# Altium project eBug2014-CameraArray.PrjPcb
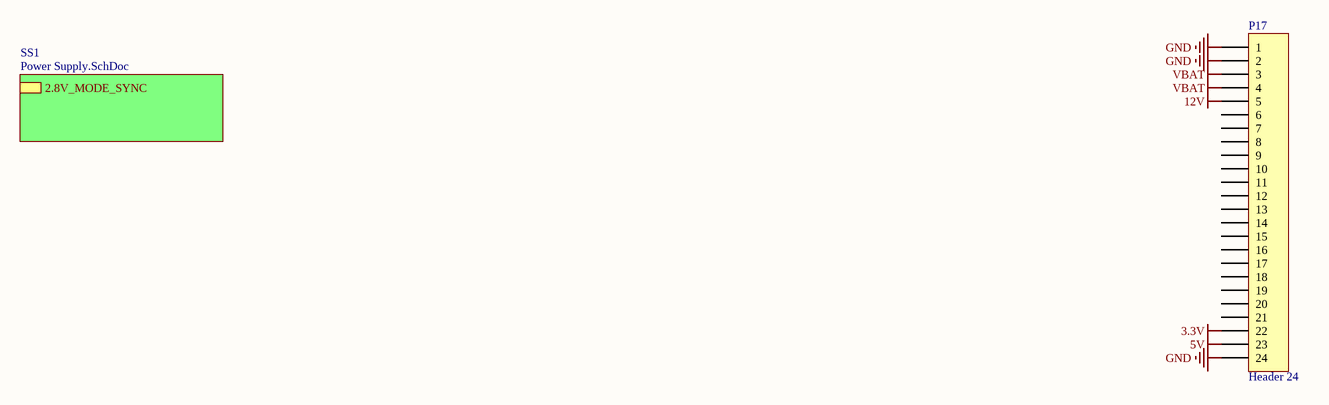
[diagram p0: Top Level.SchDoc]
11 sheets, 61 parts. Net scope: hierarchical (ports join the sheet entries above them; power ports are global).
Board file: PCB.PcbDoc
Sheets:
  Top Level.SchDoc
    SS1 = Power Supply.SchDoc
  Camera 1-2.SchDoc
  Camera 3-4.SchDoc
  Camera 5-6.SchDoc
  Camera 7-8.SchDoc
  Camera 9-10.SchDoc
  Camera 11-12.SchDoc
  Camera 13-14.SchDoc
  Camera 15-16.SchDoc
  LPC.SchDoc

## Sheet Top Level.SchDoc
size A4; DrawnBy: Nick D'Ademo; DocumentNumber: 1; Revision: A; SheetNumber: 1; SheetTotal: 11

### Parts
P17  Header 24  [2-1734592-4]

### Sub-sheets
SS1 = Power Supply.SchDoc: 2.8V_MODE_SYNC

### Nets
3.3V: P17.22
5V: P17.23
12V: P17.5
GND: P17.1 P17.2 P17.24
VBAT: P17.3 P17.4

Not connected (* = marked no-connect by the designer): P17 6 7 8 9 10 11 12 13 14 15 16 17 18 19 20 21

### Library data of the parts
P17 = Header 24: GLOBAL CONNECTOR TECHNOLOGY - FFC2B10-24-T - FFC/FPC CONNECTOR, RECEPTACLE, 24POS, 1ROW; LatestRevisionDate: 17-Jul-2002; LatestRevisionNote: Re-released for DXP Platform.; Publisher: Altium Limited

## Sheet Power Supply.SchDoc
size A; DrawnBy: Nick D'Ademo; DocumentNumber: 11; Revision: A; SheetNumber: 11; SheetTotal: 11
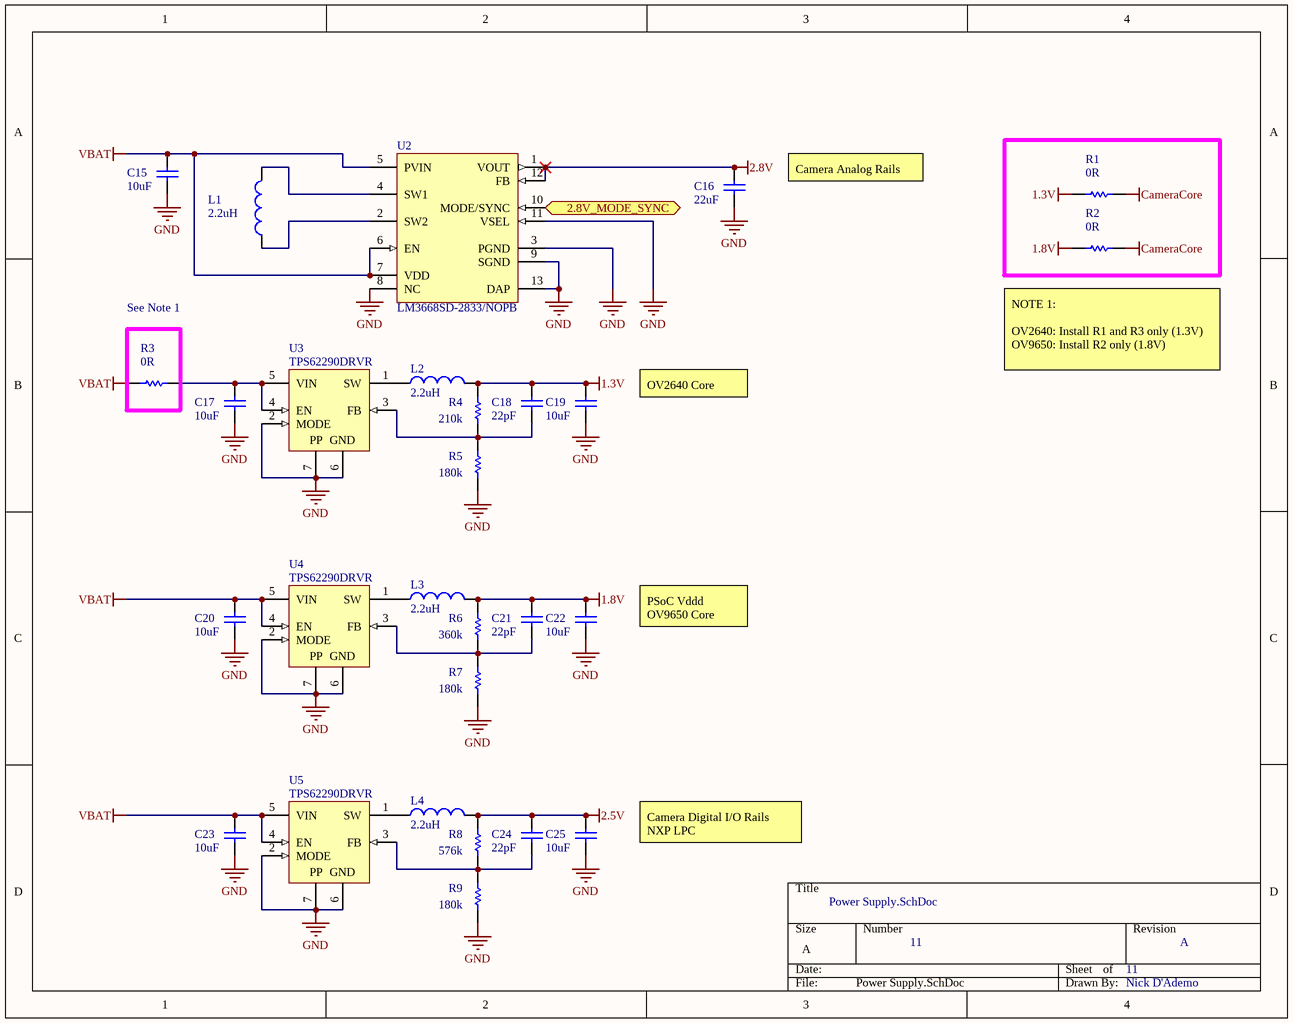
[diagram p1: Power Supply.SchDoc]

### Parts
C15  value 10uF  [CAPC2012N]  (hidden comment: Cap)
C16  value 22uF  [CAPC2012N]  (hidden comment: Cap)
C17  value 10uF  [CAPC2012N]  (hidden comment: Cap)
C18  value 22pF  [CAPC1005N]  (hidden comment: Cap)
C19  value 10uF  [CAPC2012N]  (hidden comment: Cap)
C20  value 10uF  [CAPC2012N]  (hidden comment: Cap)
C21  value 22pF  [CAPC1005N]  (hidden comment: Cap)
C22  value 10uF  [CAPC2012N]  (hidden comment: Cap)
C23  value 10uF  [CAPC2012N]  (hidden comment: Cap)
C24  value 22pF  [CAPC1005N]  (hidden comment: Cap)
C25  value 10uF  [CAPC2012N]  (hidden comment: Cap)
L1  value 2.2uH  [COILCRAFT_LPS4018]  (hidden comment: Inductor)
L2  value 2.2uH  [COILCRAFT_LPS4018]  (hidden comment: Inductor)
L3  value 2.2uH  [COILCRAFT_LPS4018]  (hidden comment: Inductor)
L4  value 2.2uH  [COILCRAFT_LPS4018]  (hidden comment: Inductor)
R1  value 0R  [RESC1608N]  (hidden comment: Res1)
R2  value 0R  [RESC1608N]  (hidden comment: Res1)
R3  value 0R  [RESC1608N]  (hidden comment: Res1)
R4  value 210k  [RESC1608N]  (hidden comment: Res1)
R5  value 180k  [RESC1608N]  (hidden comment: Res1)
R6  value 360k  [RESC1608N]  (hidden comment: Res1)
R7  value 180k  [RESC1608N]  (hidden comment: Res1)
R8  value 576k  [RESC1608N]  (hidden comment: Res1)
R9  value 180k  [RESC1608N]  (hidden comment: Res1)
U2  LM3668SD-2833/NOPB  [SDF12A]
U3  TPS62290DRVR  [DRV6-1600X1000TP]
U4  TPS62290DRVR  [DRV6-1600X1000TP]
U5  TPS62290DRVR  [DRV6-1600X1000TP]

### Blocks framed on the sheet
See Note 1: R3

### Ports
2.8V_MODE_SYNC

### Nets
1.3V: C18.2 C19.2 L2.2 R1.2 R4.2
1.8V: C21.2 C22.2 L3.2 R2.2 R6.2
2.5V: C24.2 C25.2 L4.2 R8.2
2.8V: C16.2 U2.1(VOUT) U2.12(FB)
CameraCore: R1.1 R2.1
GND: C15.1 C16.1 C17.1 C19.1 C20.1 C22.1 C23.1 C25.1 R5.1 R7.1 R9.1 U2.3(PGND) U2.8(NC) U2.9(SGND) U2.11(VSEL) U2.13(DAP) U3.2(MODE) U3.6(GND) U3.7(PP) U4.2(MODE) U4.6(GND) U4.7(PP) U5.2(MODE) U5.6(GND) U5.7(PP)
VBAT: C15.2 C20.2 C23.2 R3.2 U2.5(PVIN) U2.6(EN) U2.7(VDD) U4.4(EN) U4.5(VIN) U5.4(EN) U5.5(VIN)
NetC17_2: C17.2 R3.1 U3.4(EN) U3.5(VIN)
NetC18_1: C18.1 R4.1 R5.2 U3.3(FB)
NetC21_1: C21.1 R6.1 R7.2 U4.3(FB)
NetC24_1: C24.1 R8.1 R9.2 U5.3(FB)
NetL1_1: L1.1 U2.2(SW2)
NetL1_2: L1.2 U2.4(SW1)
NetL2_1: L2.1 U3.1(SW)
NetL3_1: L3.1 U4.1(SW)
NetL4_1: L4.1 U5.1(SW)
NetU2_10: U2.10(MODE/SYNC) ; port 2.8V_MODE_SYNC

### Notes on the sheet
- Camera Analog Rails
- (near R2) NOTE 1:
  OV2640: Install R1 and R3 only (1.3V)
  OV9650: Install R2 only (1.8V)
- OV2640 Core
- PSoC Vddd
  OV9650 Core
- Camera Digital I/O Rails
  NXP LPC

### Library data of the parts
C15 C17 C19 C20 C22 C23 C25 = Cap: TAIYO YUDEN - LMK212 BJ106MG-T - CAP, MLCC, X5R, 10UF, 10V, 0805; Published: 8-Jun-2000; LatestRevisionDate: 17-Jul-2002; LatestRevisionNote: Re-released for DXP Platform.; PackageReference: RAD-0.3; Publisher: Altium Limited; PackageDescription: Radial Cap, Thru-Hole; 2 Leads; 0.3 in Pin Spacing
C16 = Cap: TAIYO YUDEN - LMK212BJ226MG-T - CAPACITOR CERAMIC 22UF, 10V, X5R, 0805; Published: 8-Jun-2000; LatestRevisionDate: 17-Jul-2002; LatestRevisionNote: Re-released for DXP Platform.; PackageReference: RAD-0.3; Publisher: Altium Limited; PackageDescription: Radial Cap, Thru-Hole; 2 Leads; 0.3 in Pin Spacing
C18 C21 C24 = Cap: Capacitor, NP0, ±5%, 25V, 0402; Published: 8-Jun-2000; LatestRevisionDate: 17-Jul-2002; LatestRevisionNote: Re-released for DXP Platform.; PackageReference: RAD-0.3; Publisher: Altium Limited; PackageDescription: Radial Cap, Thru-Hole; 2 Leads; 0.3 in Pin Spacing
L1-L4 = Inductor: COILCRAFT - LPS4018-222MRB - INDUCTOR, SHLD, 2.2UH, 20%, 1.5A, SMD; Code_IEC: 1005; Published: 8-Jun-2000; LatestRevisionDate: 29-May-2009; LatestRevisionNote: IPC-7351 Footprint Added.; PackageReference: 0402-A; Publisher: Altium Limited; PackageDescription: Chip Inductor; Code_JEITA: 0402
R1-R9 = Res1: Resistor, ±1%, 0.1W, 0603; Published: 8-Jun-2000; LatestRevisionDate: 17-Jul-2002; LatestRevisionNote: Re-released for DXP Platform.; PackageReference: AXIAL-0.3; Publisher: Altium Limited; PackageDescription: Axial Device, Thru-Hole; 2 Leads; 0.3 in Pin Spacing
U2 = LM3668SD-2833/NOPB: 1A, High Efficiency Dual Mode Single Inductor Buck-Boost DC/DC Converter, 12-pin LLP, Pb-Free; Manufacturer: National Semiconductor; PackageTopMarking: ZXYTT*S017B; PowerWise: Y; CompType: MiscPower; DatasheetVersion: Sep-2008; PackageVersion: revB, Jul-2008; PackageReference: SDF12A; PackageDescription: LLP, Plastic, Dual, 3 x 3 x 0.8mm Body, 12 Lead, 0.4mm Pitch, No Pullback; PartNumber: LM3668SD-2833/NOPB; RoHS: Y; PinCount: 12; High-Reliability: Y; ComponentLink1Description: Manufacturer URL; ComponentLink1URL: http://www.national.com/; ComponentLink2Description: LM3668 Datasheet; ComponentLink2URL: http://www.national.com/ds/LM/LM3668.pdf; ComponentLink3Description: LM3668 Web Page; ComponentLink3URL: http://www.national.com/pf/LM/LM3668.html; ComponentLink4Description: SDF12A Package Page; ComponentLink4URL: http://www.national.com/packaging/folders/sdf12a.html
U3-U5 = TPS62290DRVR: Buck Step Down Regulator with 2.3 to 6 V Input and 0.6 to 6 V Output, -40 to 85 degC, 6-Pin SON (DRV), Green (RoHS & no Sb/Br); Manufacturer: Texas Instruments; Duty Cycle(Max)(%): 100; Iout(Max)(A): 1; Iq(Typ)(mA): 0.015; Rating: Catalog; SubFamily: Step-Down Regulator; Switch Current Limit(Typ)(A): 1.4; Synchronous Rectification: TRUE; Vin(Max)(V): 6; Vin(Min)(V): 2.3; Vout(Min)(V): 0.6; DatasheetVersion: SLVS764C; PackageVersion: revE, Oct-2010; PackageReference: DRV6-1600X1000TP; PackageDescription: 6-Pin Plastic Small Outline No-Lead, 2 x 2 x 0.8 mm Body, 0.65 mm Pitch, Exposed Pad; Supplier 1: Digi-Key; Supplier Part Number 1: 296-27030-2-ND; Supplier 2: Digi-Key; Supplier Part Number 2: 296-27030-1-ND; Supplier 3: Digi-Key; Supplier Part Number 3: 296-27030-6-ND; Supplier 4: Newark; Supplier Part Number 4: 50M9135; Supplier 5: Mouser; Supplier Part Number 5: 595-TPS62290DRVR; Eco-Plan: Green (RoHS & no Sb/Br); Regulated Outputs(#): 1; Topology: Buck; Vout(Max)(V): 6; Mounting Technology: Surface Mount; PartNumber: TPS62290DRVR; ComponentLink1Description: Datasheet; ComponentLink1URL: http://www.ti.com/general/docs/lit/getliterature.tsp?genericPartNumber=TPS62290&fileType=pdf; ComponentLink2Description: Package Specification; ComponentLink2URL: http://www.ti.com/litv/pdf/mpds216d; ComponentLink3Description: URL Link1; ComponentLink3URL: Samples URL:http://www.ti.com/product/tps62290#samples

## Sheet Camera 1-2.SchDoc
size A; DrawnBy: Nick D'Ademo; DocumentNumber: 2; Revision: A; SheetNumber: 2; SheetTotal: 11
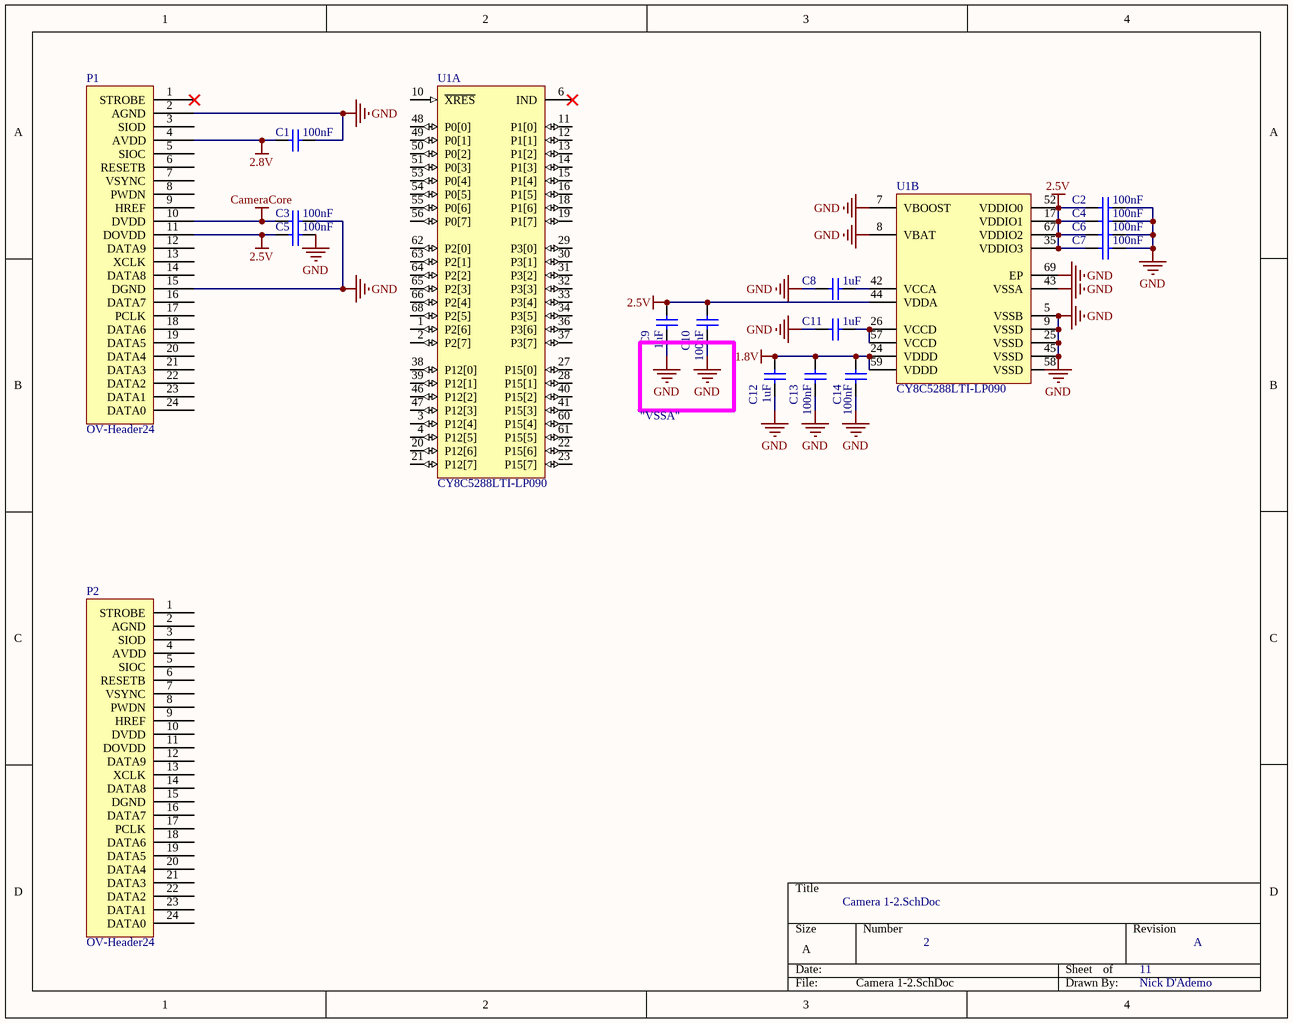
[diagram p2: Camera 1-2.SchDoc]

### Parts
C1  value 100nF  [CAPC1005N]  (hidden comment: Cap)
C2  value 100nF  [CAPC1005N]  (hidden comment: Cap)
C3  value 100nF  [CAPC1005N]  (hidden comment: Cap)
C4  value 100nF  [CAPC1005N]  (hidden comment: Cap)
C5  value 100nF  [CAPC1005N]  (hidden comment: Cap)
C6  value 100nF  [CAPC1005N]  (hidden comment: Cap)
C7  value 100nF  [CAPC1005N]  (hidden comment: Cap)
C8  value 1uF  [CAPC1005N]  (hidden comment: Cap)
C9  value 1uF  [CAPC1005N]  (hidden comment: Cap)
C10  value 100nF  [CAPC1005N]  (hidden comment: Cap)
C11  value 1uF  [CAPC1005N]  (hidden comment: Cap)
C12  value 1uF  [CAPC1005N]  (hidden comment: Cap)
C13  value 100nF  [CAPC1005N]  (hidden comment: Cap)
C14  value 100nF  [CAPC1005N]  (hidden comment: Cap)
P1  OV-Header24  [2-1734592-4_REVERSED]
P2  OV-Header24  [2-1734592-4_REVERSED]
U1  CY8C5288LTI-LP090  [CYP-LTX68_N]  (parts A,B of 2)

### Nets
1.8V: C12.2 C13.1 C14.1 U1.24(VDDD) U1.59(VDDD)
2.5V: C2.2 C4.2 C5.2 C6.2 C7.2 C9.2 C10.1 P1.11(DOVDD) U1.17(VDDIO1) U1.35(VDDIO3) U1.44(VDDA) U1.52(VDDIO0) U1.67(VDDIO2)
2.8V: C1.2 P1.4(AVDD)
CameraCore: C3.2 P1.10(DVDD)
GND: C1.1 C2.1 C3.1 C4.1 C5.1 C6.1 C7.1 C8.1 C9.1 C10.2 C11.1 C12.1 C13.2 C14.2 P1.2(AGND) P1.15(DGND) U1.5(VSSB) U1.7(VBOOST) U1.8(VBAT) U1.9(VSSD) U1.25(VSSD) U1.43(VSSA) U1.45(VSSD) U1.69(EP)
NetC8_2: C8.2 U1.42(VCCA)
NetC11_2: C11.2 U1.26(VCCD) U1.57(VCCD)

Not connected (* = marked no-connect by the designer): P1 1(STROBE)* 3(SIOD) 5(SIOC) 6(RESETB) 7(VSYNC) 8(PWDN) 9(HREF) 12(DATA9) 13(XCLK) 14(DATA8) 16(DATA7) 17(PCLK) 18(DATA6) 19(DATA5) 20(DATA4) 21(DATA3) 22(DATA2) 23(DATA1) 24(DATA0); P2 1(STROBE) 2(AGND) 3(SIOD) 4(AVDD) 5(SIOC) 6(RESETB) 7(VSYNC) 8(PWDN) 9(HREF) 10(DVDD) 11(DOVDD) 12(DATA9) 13(XCLK) 14(DATA8) 15(DGND) 16(DATA7) 17(PCLK) 18(DATA6) 19(DATA5) 20(DATA4) 21(DATA3) 22(DATA2) 23(DATA1) 24(DATA0); U1 1(P2[6]) 2(P2[7]) 3(P12[4]) 4(P12[5]) 6(IND)* 10(~{XRES}) 11(P1[0]) 12(P1[1]) 13(P1[2]) 14(P1[3]) 15(P1[4]) 16(P1[5]) 18(P1[6]) 19(P1[7]) 20(P12[6]) 21(P12[7]) 22(P15[6]) 23(P15[7]) 27(P15[0]) 28(P15[1]) 29(P3[0]) 30(P3[1]) 31(P3[2]) 32(P3[3]) 33(P3[4]) 34(P3[5]) 36(P3[6]) 37(P3[7]) 38(P12[0]) 39(P12[1]) 40(P15[2]) 41(P15[3]) 46(P12[2]) 47(P12[3]) 48(P0[0]) 49(P0[1]) 50(P0[2]) 51(P0[3]) 53(P0[4]) 54(P0[5]) 55(P0[6]) 56(P0[7]) 58(VSSD) 60(P15[4]) 61(P15[5]) 62(P2[0]) 63(P2[1]) 64(P2[2]) 65(P2[3]) 66(P2[4]) 68(P2[5])

### Notes on the sheet
- "VSSA"

### Library data of the parts
C1-C7 C10 C13 C14 = Cap: Capacitor, X7R, ±10%, 16V, 0402; Published: 8-Jun-2000; LatestRevisionDate: 17-Jul-2002; LatestRevisionNote: Re-released for DXP Platform.; PackageReference: RAD-0.3; Publisher: Altium Limited; PackageDescription: Radial Cap, Thru-Hole; 2 Leads; 0.3 in Pin Spacing
C8 C9 C11 C12 = Cap: Capacitor, X5R, ±10%, 10V, 0402; Published: 8-Jun-2000; LatestRevisionDate: 17-Jul-2002; LatestRevisionNote: Re-released for DXP Platform.; PackageReference: RAD-0.3; Publisher: Altium Limited; PackageDescription: Radial Cap, Thru-Hole; 2 Leads; 0.3 in Pin Spacing
P1 P2 = OV-Header24: TE CONNECTIVITY - 2-1734592-4 - CONN FPC BOTTOM 24POS 0.50MM R/A
U1 = CY8C5288LTI-LP089: PSoC Programmable System-on-Chip, 256 KB Flash, 38 GPIOs, 1.71 to 5.5 V, 68-Pin QFN (LTX68), Tray; Manufacturer: Cypress; CPU Core: ARM Cortex-M3; Flash (KB): 256; Max. Operating Frequency (MHz): 80; Max. Operating Voltage (V): 5.5; Min. Operating Voltage (V): 1.71; No. of GPIOs: 38; SRAM (KB): 64; DatasheetVersion: Rev. *D; PackageVersion: Rev. *E, 07/2012; PackageReference: LTX68; PackageDescription: 68-Pin Quad Flat No Lead, Body 8.00 x 8.00 mm, Pitch 0.40 mm; Max. Operating Temp. (degreesC): 85; Min. Operating Temp. (degreesC): -40; Packing: Tray; Mounting Technology: Surface Mount; Code_JEDEC: MO-220; PartNumber: CY8C5288LTI-LP089; ComponentLink1Description: Manufacturer URL; ComponentLink1URL: http://www.cypress.com/; ComponentLink2Description: Datasheet; ComponentLink2URL: http://www.cypress.com/?docID=47569; ComponentLink3Description: Package Specification; ComponentLink3URL: http://www.cypress.com/?docID=38892

## Sheet Camera 3-4.SchDoc
size A; DrawnBy: Nick D'Ademo; DocumentNumber: 3; Revision: A; SheetNumber: 3; SheetTotal: 11
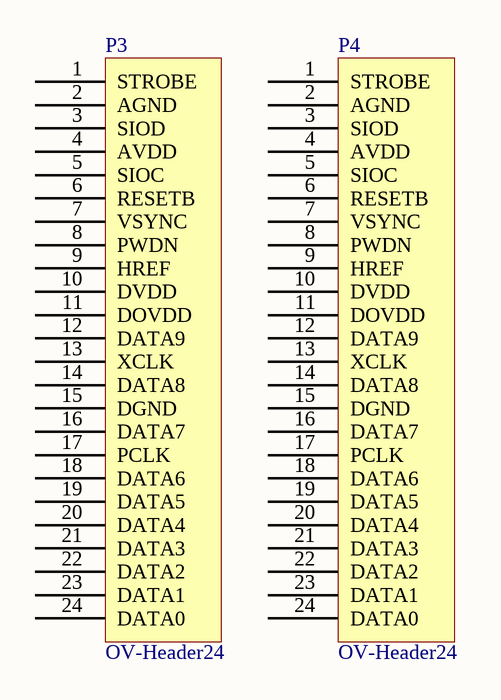
[diagram p3: Camera 3-4.SchDoc]

### Parts
P3  OV-Header24  [2-1734592-4_REVERSED]
P4  OV-Header24  [2-1734592-4_REVERSED]

### Nets

Not connected (* = marked no-connect by the designer): P3 1(STROBE) 2(AGND) 3(SIOD) 4(AVDD) 5(SIOC) 6(RESETB) 7(VSYNC) 8(PWDN) 9(HREF) 10(DVDD) 11(DOVDD) 12(DATA9) 13(XCLK) 14(DATA8) 15(DGND) 16(DATA7) 17(PCLK) 18(DATA6) 19(DATA5) 20(DATA4) 21(DATA3) 22(DATA2) 23(DATA1) 24(DATA0); P4 1(STROBE) 2(AGND) 3(SIOD) 4(AVDD) 5(SIOC) 6(RESETB) 7(VSYNC) 8(PWDN) 9(HREF) 10(DVDD) 11(DOVDD) 12(DATA9) 13(XCLK) 14(DATA8) 15(DGND) 16(DATA7) 17(PCLK) 18(DATA6) 19(DATA5) 20(DATA4) 21(DATA3) 22(DATA2) 23(DATA1) 24(DATA0)

### Library data of the parts
P3 P4 = OV-Header24: as P1 on sheet Camera 1-2

## Sheet Camera 5-6.SchDoc
size A; DrawnBy: Nick D'Ademo; DocumentNumber: 4; Revision: A; SheetNumber: 4; SheetTotal: 11
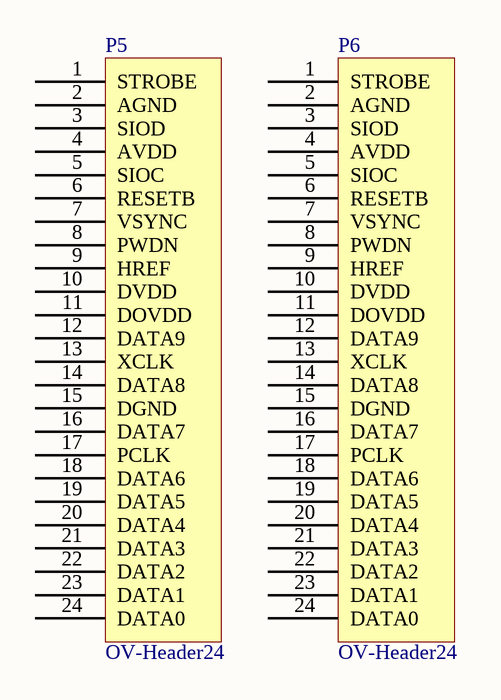
[diagram p4: Camera 5-6.SchDoc]

### Parts
P5  OV-Header24  [2-1734592-4_REVERSED]
P6  OV-Header24  [2-1734592-4_REVERSED]

### Nets

Not connected (* = marked no-connect by the designer): P5 1(STROBE) 2(AGND) 3(SIOD) 4(AVDD) 5(SIOC) 6(RESETB) 7(VSYNC) 8(PWDN) 9(HREF) 10(DVDD) 11(DOVDD) 12(DATA9) 13(XCLK) 14(DATA8) 15(DGND) 16(DATA7) 17(PCLK) 18(DATA6) 19(DATA5) 20(DATA4) 21(DATA3) 22(DATA2) 23(DATA1) 24(DATA0); P6 1(STROBE) 2(AGND) 3(SIOD) 4(AVDD) 5(SIOC) 6(RESETB) 7(VSYNC) 8(PWDN) 9(HREF) 10(DVDD) 11(DOVDD) 12(DATA9) 13(XCLK) 14(DATA8) 15(DGND) 16(DATA7) 17(PCLK) 18(DATA6) 19(DATA5) 20(DATA4) 21(DATA3) 22(DATA2) 23(DATA1) 24(DATA0)

### Library data of the parts
P5 P6 = OV-Header24: as P1 on sheet Camera 1-2

## Sheet Camera 7-8.SchDoc
size A; DrawnBy: Nick D'Ademo; DocumentNumber: 5; Revision: A; SheetNumber: 5; SheetTotal: 11
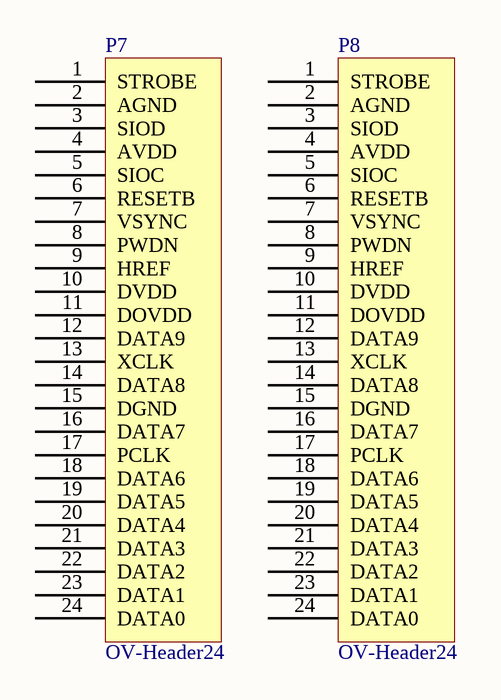
[diagram p5: Camera 7-8.SchDoc]

### Parts
P7  OV-Header24  [2-1734592-4_REVERSED]
P8  OV-Header24  [2-1734592-4_REVERSED]

### Nets

Not connected (* = marked no-connect by the designer): P7 1(STROBE) 2(AGND) 3(SIOD) 4(AVDD) 5(SIOC) 6(RESETB) 7(VSYNC) 8(PWDN) 9(HREF) 10(DVDD) 11(DOVDD) 12(DATA9) 13(XCLK) 14(DATA8) 15(DGND) 16(DATA7) 17(PCLK) 18(DATA6) 19(DATA5) 20(DATA4) 21(DATA3) 22(DATA2) 23(DATA1) 24(DATA0); P8 1(STROBE) 2(AGND) 3(SIOD) 4(AVDD) 5(SIOC) 6(RESETB) 7(VSYNC) 8(PWDN) 9(HREF) 10(DVDD) 11(DOVDD) 12(DATA9) 13(XCLK) 14(DATA8) 15(DGND) 16(DATA7) 17(PCLK) 18(DATA6) 19(DATA5) 20(DATA4) 21(DATA3) 22(DATA2) 23(DATA1) 24(DATA0)

### Library data of the parts
P7 P8 = OV-Header24: as P1 on sheet Camera 1-2

## Sheet Camera 9-10.SchDoc
size A; DrawnBy: Nick D'Ademo; DocumentNumber: 6; Revision: A; SheetNumber: 6; SheetTotal: 11
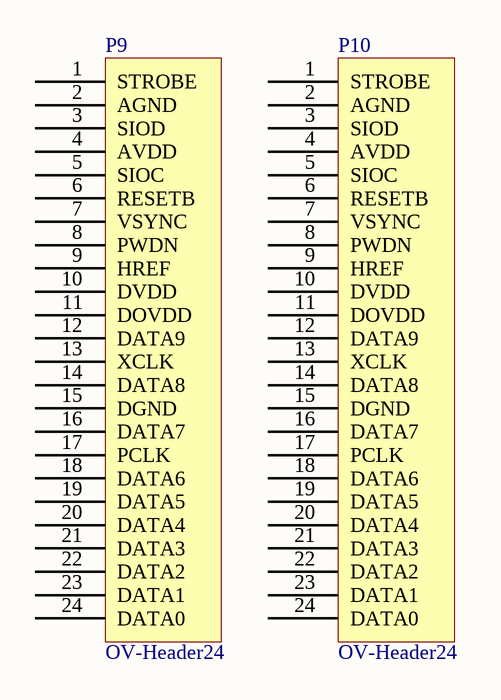
[diagram p6: Camera 9-10.SchDoc]

### Parts
P9  OV-Header24  [2-1734592-4_REVERSED]
P10  OV-Header24  [2-1734592-4_REVERSED]

### Nets

Not connected (* = marked no-connect by the designer): P9 1(STROBE) 2(AGND) 3(SIOD) 4(AVDD) 5(SIOC) 6(RESETB) 7(VSYNC) 8(PWDN) 9(HREF) 10(DVDD) 11(DOVDD) 12(DATA9) 13(XCLK) 14(DATA8) 15(DGND) 16(DATA7) 17(PCLK) 18(DATA6) 19(DATA5) 20(DATA4) 21(DATA3) 22(DATA2) 23(DATA1) 24(DATA0); P10 1(STROBE) 2(AGND) 3(SIOD) 4(AVDD) 5(SIOC) 6(RESETB) 7(VSYNC) 8(PWDN) 9(HREF) 10(DVDD) 11(DOVDD) 12(DATA9) 13(XCLK) 14(DATA8) 15(DGND) 16(DATA7) 17(PCLK) 18(DATA6) 19(DATA5) 20(DATA4) 21(DATA3) 22(DATA2) 23(DATA1) 24(DATA0)

### Library data of the parts
P9 P10 = OV-Header24: as P1 on sheet Camera 1-2

## Sheet Camera 11-12.SchDoc
size A; DrawnBy: Nick D'Ademo; DocumentNumber: 7; Revision: A; SheetNumber: 7; SheetTotal: 11
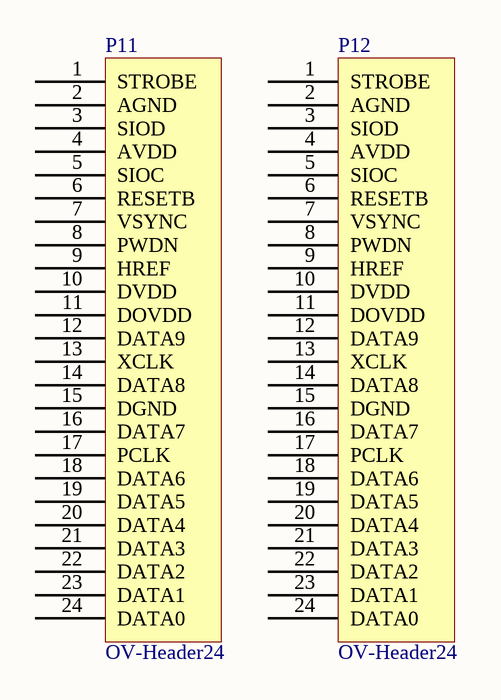
[diagram p7: Camera 11-12.SchDoc]

### Parts
P11  OV-Header24  [2-1734592-4_REVERSED]
P12  OV-Header24  [2-1734592-4_REVERSED]

### Nets

Not connected (* = marked no-connect by the designer): P11 1(STROBE) 2(AGND) 3(SIOD) 4(AVDD) 5(SIOC) 6(RESETB) 7(VSYNC) 8(PWDN) 9(HREF) 10(DVDD) 11(DOVDD) 12(DATA9) 13(XCLK) 14(DATA8) 15(DGND) 16(DATA7) 17(PCLK) 18(DATA6) 19(DATA5) 20(DATA4) 21(DATA3) 22(DATA2) 23(DATA1) 24(DATA0); P12 1(STROBE) 2(AGND) 3(SIOD) 4(AVDD) 5(SIOC) 6(RESETB) 7(VSYNC) 8(PWDN) 9(HREF) 10(DVDD) 11(DOVDD) 12(DATA9) 13(XCLK) 14(DATA8) 15(DGND) 16(DATA7) 17(PCLK) 18(DATA6) 19(DATA5) 20(DATA4) 21(DATA3) 22(DATA2) 23(DATA1) 24(DATA0)

### Library data of the parts
P11 P12 = OV-Header24: as P1 on sheet Camera 1-2

## Sheet Camera 13-14.SchDoc
size A; DrawnBy: Nick D'Ademo; DocumentNumber: 8; Revision: A; SheetNumber: 8; SheetTotal: 11
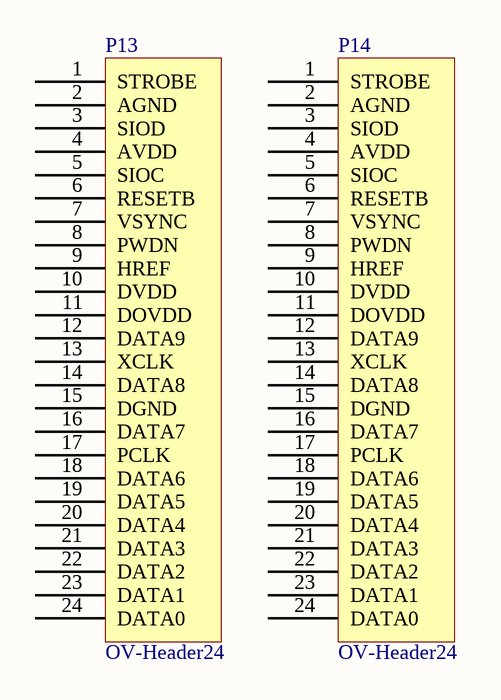
[diagram p8: Camera 13-14.SchDoc]

### Parts
P13  OV-Header24  [2-1734592-4_REVERSED]
P14  OV-Header24  [2-1734592-4_REVERSED]

### Nets

Not connected (* = marked no-connect by the designer): P13 1(STROBE) 2(AGND) 3(SIOD) 4(AVDD) 5(SIOC) 6(RESETB) 7(VSYNC) 8(PWDN) 9(HREF) 10(DVDD) 11(DOVDD) 12(DATA9) 13(XCLK) 14(DATA8) 15(DGND) 16(DATA7) 17(PCLK) 18(DATA6) 19(DATA5) 20(DATA4) 21(DATA3) 22(DATA2) 23(DATA1) 24(DATA0); P14 1(STROBE) 2(AGND) 3(SIOD) 4(AVDD) 5(SIOC) 6(RESETB) 7(VSYNC) 8(PWDN) 9(HREF) 10(DVDD) 11(DOVDD) 12(DATA9) 13(XCLK) 14(DATA8) 15(DGND) 16(DATA7) 17(PCLK) 18(DATA6) 19(DATA5) 20(DATA4) 21(DATA3) 22(DATA2) 23(DATA1) 24(DATA0)

### Library data of the parts
P13 P14 = OV-Header24: as P1 on sheet Camera 1-2

## Sheet Camera 15-16.SchDoc
size A; DrawnBy: Nick D'Ademo; DocumentNumber: 9; Revision: A; SheetNumber: 9; SheetTotal: 11
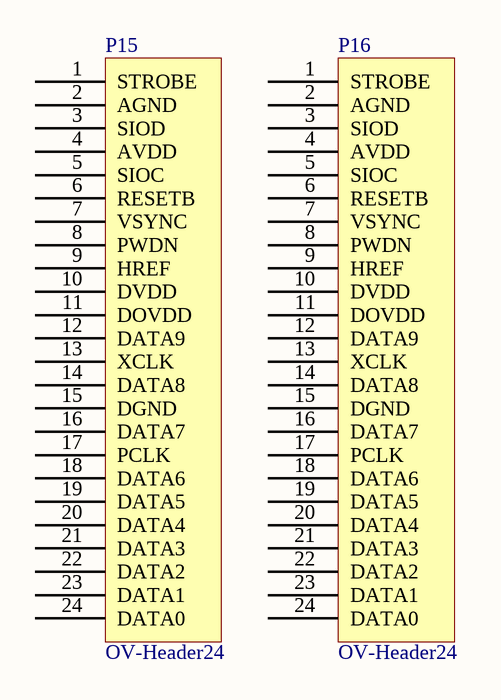
[diagram p9: Camera 15-16.SchDoc]

### Parts
P15  OV-Header24  [2-1734592-4_REVERSED]
P16  OV-Header24  [2-1734592-4_REVERSED]

### Nets

Not connected (* = marked no-connect by the designer): P15 1(STROBE) 2(AGND) 3(SIOD) 4(AVDD) 5(SIOC) 6(RESETB) 7(VSYNC) 8(PWDN) 9(HREF) 10(DVDD) 11(DOVDD) 12(DATA9) 13(XCLK) 14(DATA8) 15(DGND) 16(DATA7) 17(PCLK) 18(DATA6) 19(DATA5) 20(DATA4) 21(DATA3) 22(DATA2) 23(DATA1) 24(DATA0); P16 1(STROBE) 2(AGND) 3(SIOD) 4(AVDD) 5(SIOC) 6(RESETB) 7(VSYNC) 8(PWDN) 9(HREF) 10(DVDD) 11(DOVDD) 12(DATA9) 13(XCLK) 14(DATA8) 15(DGND) 16(DATA7) 17(PCLK) 18(DATA6) 19(DATA5) 20(DATA4) 21(DATA3) 22(DATA2) 23(DATA1) 24(DATA0)

### Library data of the parts
P15 P16 = OV-Header24: as P1 on sheet Camera 1-2

## Sheet LPC.SchDoc
size A3; DrawnBy: Nick D'Ademo; DocumentNumber: 10; Revision: A; SheetNumber: 10; SheetTotal: 11
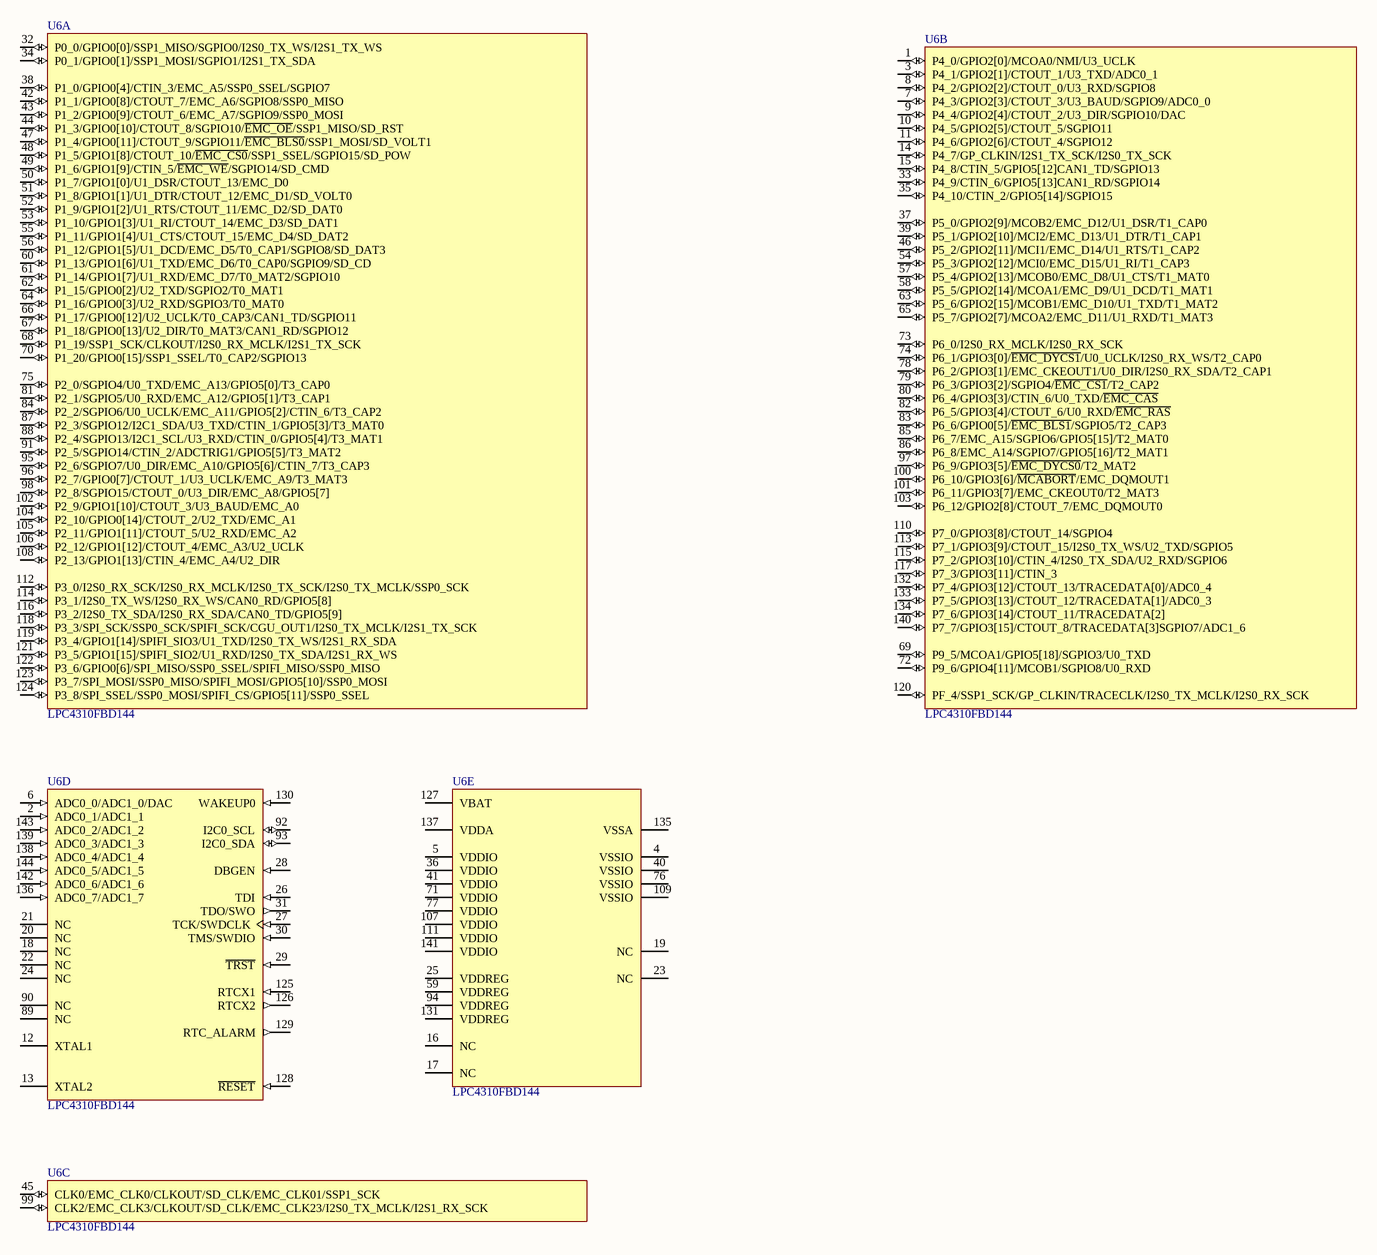
[diagram p10: LPC.SchDoc]

### Parts
U6  LPC4310FBD144  [SOT486-1_V]  (parts A,B,C,D,E of 5)

### Nets

Not connected (* = marked no-connect by the designer): U6 1(P4_0/GPIO2[0]/MCOA0/NMI/U3_UCLK) 2(ADC0_1/ADC1_1) 3(P4_1/GPIO2[1]/CTOUT_1/U3_TXD/ADC0_1) 4(VSSIO) 5(VDDIO) 6(ADC0_0/ADC1_0/DAC) 7(P4_3/GPIO2[3]/CTOUT_3/U3_BAUD/SGPIO9/ADC0_0) 8(P4_2/GPIO2[2]/CTOUT_0/U3_RXD/SGPIO8) 9(P4_4/GPIO2[4]/CTOUT_2/U3_DIR/SGPIO10/DAC) 10(P4_5/GPIO2[5]/CTOUT_5/SGPIO11) 11(P4_6/GPIO2[6]/CTOUT_4/SGPIO12) 12(XTAL1) 13(XTAL2) 14(P4_7/GP_CLKIN/I2S1_TX_SCK/I2S0_TX_SCK) 15(P4_8/CTIN_5/GPIO5[12]CAN1_TD/SGPIO13) 16(NC) 17(NC) 18(NC) 19(NC) 20(NC) 21(NC) 22(NC) 23(NC) 24(NC) 25(VDDREG) 26(TDI) 27(TCK/SWDCLK) 28(DBGEN) 29(~{TRST}) 30(TMS/SWDIO) 31(TDO/SWO) 32(P0_0/GPIO0[0]/SSP1_MISO/SGPIO0/I2S0_TX_WS/I2S1_TX_WS) 33(P4_9/CTIN_6/GPIO5[13]CAN1_RD/SGPIO14) 34(P0_1/GPIO0[1]/SSP1_MOSI/SGPIO1/I2S1_TX_SDA) 35(P4_10/CTIN_2/GPIO5[14]/SGPIO15) 36(VDDIO) 37(P5_0/GPIO2[9]/MCOB2/EMC_D12/U1_DSR/T1_CAP0) 38(P1_0/GPIO0[4]/CTIN_3/EMC_A5/SSP0_SSEL/SGPIO7) 39(P5_1/GPIO2[10]/MCI2/EMC_D13/U1_DTR/T1_CAP1) 40(VSSIO) 41(VDDIO) 42(P1_1/GPIO0[8]/CTOUT_7/EMC_A6/SGPIO8/SSP0_MISO) 43(P1_2/GPIO0[9]/CTOUT_6/EMC_A7/SGPIO9/SSP0_MOSI) 44(P1_3/GPIO0[10]/CTOUT_8/SGPIO10/~{EMC_OE}/SSP1_MISO/SD_RST) 45(CLK0/EMC_CLK0/CLKOUT/SD_CLK/EMC_CLK01/SSP1_SCK) 46(P5_2/GPIO2[11]/MCI1/EMC_D14/U1_RTS/T1_CAP2) 47(P1_4/GPIO0[11]/CTOUT_9/SGPIO11/~{EMC_BLS0}/SSP1_MOSI/SD_VOLT1) 48(P1_5/GPIO1[8]/CTOUT_10/~{EMC_CS0}/SSP1_SSEL/SGPIO15/SD_POW) 49(P1_6/GPIO1[9]/CTIN_5/~{EMC_WE}/SGPIO14/SD_CMD) 50(P1_7/GPIO1[0]/U1_DSR/CTOUT_13/EMC_D0) 51(P1_8/GPIO1[1]/U1_DTR/CTOUT_12/EMC_D1/SD_VOLT0) 52(P1_9/GPIO1[2]/U1_RTS/CTOUT_11/EMC_D2/SD_DAT0) 53(P1_10/GPIO1[3]/U1_RI/CTOUT_14/EMC_D3/SD_DAT1) 54(P5_3/GPIO2[12]/MCI0/EMC_D15/U1_RI/T1_CAP3) 55(P1_11/GPIO1[4]/U1_CTS/CTOUT_15/EMC_D4/SD_DAT2) 56(P1_12/GPIO1[5]/U1_DCD/EMC_D5/T0_CAP1/SGPIO8/SD_DAT3) 57(P5_4/GPIO2[13]/MCOB0/EMC_D8/U1_CTS/T1_MAT0) 58(P5_5/GPIO2[14]/MCOA1/EMC_D9/U1_DCD/T1_MAT1) 59(VDDREG) 60(P1_13/GPIO1[6]/U1_TXD/EMC_D6/T0_CAP0/SGPIO9/SD_CD) 61(P1_14/GPIO1[7]/U1_RXD/EMC_D7/T0_MAT2/SGPIO10) 62(P1_15/GPIO0[2]/U2_TXD/SGPIO2/T0_MAT1) 63(P5_6/GPIO2[15]/MCOB1/EMC_D10/U1_TXD/T1_MAT2) 64(P1_16/GPIO0[3]/U2_RXD/SGPIO3/T0_MAT0) 65(P5_7/GPIO2[7]/MCOA2/EMC_D11/U1_RXD/T1_MAT3) 66(P1_17/GPIO0[12]/U2_UCLK/T0_CAP3/CAN1_TD/SGPIO11) 67(P1_18/GPIO0[13]/U2_DIR/T0_MAT3/CAN1_RD/SGPIO12) 68(P1_19/SSP1_SCK/CLKOUT/I2S0_RX_MCLK/I2S1_TX_SCK) 69(P9_5/MCOA1/GPIO5[18]/SGPIO3/U0_TXD) 70(P1_20/GPIO0[15]/SSP1_SSEL/T0_CAP2/SGPIO13) 71(VDDIO) 72(P9_6/GPIO4[11]/MCOB1/SGPIO8/U0_RXD) 73(P6_0/I2S0_RX_MCLK/I2S0_RX_SCK) 74(P6_1/GPIO3[0]/~{EMC_DYCS1}/U0_UCLK/I2S0_RX_WS/T2_CAP0) 75(P2_0/SGPIO4/U0_TXD/EMC_A13/GPIO5[0]/T3_CAP0) 76(VSSIO) 77(VDDIO) 78(P6_2/GPIO3[1]/EMC_CKEOUT1/U0_DIR/I2S0_RX_SDA/T2_CAP1) 79(P6_3/GPIO3[2]/SGPIO4/~{EMC_CS1}/T2_CAP2) 80(P6_4/GPIO3[3]/CTIN_6/U0_TXD/~{EMC_CAS}) 81(P2_1/SGPIO5/U0_RXD/EMC_A12/GPIO5[1]/T3_CAP1) 82(P6_5/GPIO3[4]/CTOUT_6/U0_RXD/~{EMC_RAS}) 83(P6_6/GPIO0[5]/~{EMC_BLS1}/SGPIO5/T2_CAP3) 84(P2_2/SGPIO6/U0_UCLK/EMC_A11/GPIO5[2]/CTIN_6/T3_CAP2) 85(P6_7/EMC_A15/SGPIO6/GPIO5[15]/T2_MAT0) 86(P6_8/EMC_A14/SGPIO7/GPIO5[16]/T2_MAT1) 87(P2_3/SGPIO12/I2C1_SDA/U3_TXD/CTIN_1/GPIO5[3]/T3_MAT0) 88(P2_4/SGPIO13/I2C1_SCL/U3_RXD/CTIN_0/GPIO5[4]/T3_MAT1) 89(NC) 90(NC) 91(P2_5/SGPIO14/CTIN_2/ADCTRIG1/GPIO5[5]/T3_MAT2) 92(I2C0_SCL) 93(I2C0_SDA) 94(VDDREG) 95(P2_6/SGPIO7/U0_DIR/EMC_A10/GPIO5[6]/CTIN_7/T3_CAP3) 96(P2_7/GPIO0[7]/CTOUT_1/U3_UCLK/EMC_A9/T3_MAT3) 97(P6_9/GPIO3[5]/~{EMC_DYCS0}/T2_MAT2) 98(P2_8/SGPIO15/CTOUT_0/U3_DIR/EMC_A8/GPIO5[7]) 99(CLK2/EMC_CLK3/CLKOUT/SD_CLK/EMC_CLK23/I2S0_TX_MCLK/I2S1_RX_SCK) 100(P6_10/GPIO3[6]/~{MCABORT}/EMC_DQMOUT1) 101(P6_11/GPIO3[7]/EMC_CKEOUT0/T2_MAT3) 102(P2_9/GPIO1[10]/CTOUT_3/U3_BAUD/EMC_A0) 103(P6_12/GPIO2[8]/CTOUT_7/EMC_DQMOUT0) 104(P2_10/GPIO0[14]/CTOUT_2/U2_TXD/EMC_A1) 105(P2_11/GPIO1[11]/CTOUT_5/U2_RXD/EMC_A2) 106(P2_12/GPIO1[12]/CTOUT_4/EMC_A3/U2_UCLK) 107(VDDIO) 108(P2_13/GPIO1[13]/CTIN_4/EMC_A4/U2_DIR) 109(VSSIO) 110(P7_0/GPIO3[8]/CTOUT_14/SGPIO4) 111(VDDIO) 112(P3_0/I2S0_RX_SCK/I2S0_RX_MCLK/I2S0_TX_SCK/I2S0_TX_MCLK/SSP0_SCK) 113(P7_1/GPIO3[9]/CTOUT_15/I2S0_TX_WS/U2_TXD/SGPIO5) 114(P3_1/I2S0_TX_WS/I2S0_RX_WS/CAN0_RD/GPIO5[8]) 115(P7_2/GPIO3[10]/CTIN_4/I2S0_TX_SDA/U2_RXD/SGPIO6) 116(P3_2/I2S0_TX_SDA/I2S0_RX_SDA/CAN0_TD/GPIO5[9]) 117(P7_3/GPIO3[11]/CTIN_3) 118(P3_3/SPI_SCK/SSP0_SCK/SPIFI_SCK/CGU_OUT1/I2S0_TX_MCLK/I2S1_TX_SCK) 119(P3_4/GPIO1[14]/SPIFI_SIO3/U1_TXD/I2S0_TX_WS/I2S1_RX_SDA) 120(PF_4/SSP1_SCK/GP_CLKIN/TRACECLK/I2S0_TX_MCLK/I2S0_RX_SCK) 121(P3_5/GPIO1[15]/SPIFI_SIO2/U1_RXD/I2S0_TX_SDA/I2S1_RX_WS) 122(P3_6/GPIO0[6]/SPI_MISO/SSP0_SSEL/SPIFI_MISO/SSP0_MISO) 123(P3_7/SPI_MOSI/SSP0_MISO/SPIFI_MOSI/GPIO5[10]/SSP0_MOSI) 124(P3_8/SPI_SSEL/SSP0_MOSI/SPIFI_CS/GPIO5[11]/SSP0_SSEL) 125(RTCX1) 126(RTCX2) 127(VBAT) 128(~{RESET}) 129(RTC_ALARM) 130(WAKEUP0) 131(VDDREG) 132(P7_4/GPIO3[12]/CTOUT_13/TRACEDATA[0]/ADC0_4) 133(P7_5/GPIO3[13]/CTOUT_12/TRACEDATA[1]/ADC0_3) 134(P7_6/GPIO3[14]/CTOUT_11/TRACEDATA[2]) 135(VSSA) 136(ADC0_7/ADC1_7) 137(VDDA) 138(ADC0_4/ADC1_4) 139(ADC0_3/ADC1_3) 140(P7_7/GPIO3[15]/CTOUT_8/TRACEDATA[3]SGPIO7/ADC1_6) 141(VDDIO) 142(ADC0_6/ADC1_6) 143(ADC0_2/ADC1_2) 144(ADC0_5/ADC1_5)

### Library data of the parts
U6 = LPC4310FBD144: 32-bit ARM Cortex-M4 MCU, 168 kB SRAM, CAN, AES, SPIFI, SGPIO, SCT, 144-Pin LQFP; fmax: 204 MHz; GPIOs: 83; SRAM: 168 kB; ROM: 64 kB; ADC channels: 8; PWM: Y; I2C: 2; SPI: 1; UART: 4; VDD (min): 2.2 V; VDD (max): 3.6 V; Code_IEC: 136E23; DatasheetVersion: Rev.3.1, Jan-2012; PackageVersion: Feb-2003; PackageReference: SOT486-1; PackageDescription: LQFP144: Plastic Low Profile Quad Flat Package; 144 Leads; Body 20 x 20 x 1.4 mm; PLL: Y; CAN: 2; Timers: 4; Code_JEDEC: MS-026; PartNumber: LPC4310FBD144; ComponentLink1Description: Manufacturer URL; ComponentLink1URL: http://www.nxp.com/; ComponentLink2Description: Datasheet; ComponentLink2URL: http://www.nxp.com/documents/data_sheet/LPC4350_30_20_10.pdf

## Nets that join several sheets
1.8V: Power Supply (5 pins), Camera 1-2 (5 pins)
2.5V: Power Supply (C24.2 C25.2 L4.2 R8.2), Camera 1-2 (13 pins)
2.8V: Power Supply (C16.2 U2.1 U2.12), Camera 1-2 (C1.2 P1.4)
CameraCore: Power Supply (R1.1 R2.1), Camera 1-2 (C3.2 P1.10)
GND: Top Level (P17.1 P17.2 P17.24), Power Supply (25 pins), Camera 1-2 (24 pins)
VBAT: Top Level (P17.3 P17.4), Power Supply (11 pins)